# EAGLE design 01 (EAGLE 7.2.0)
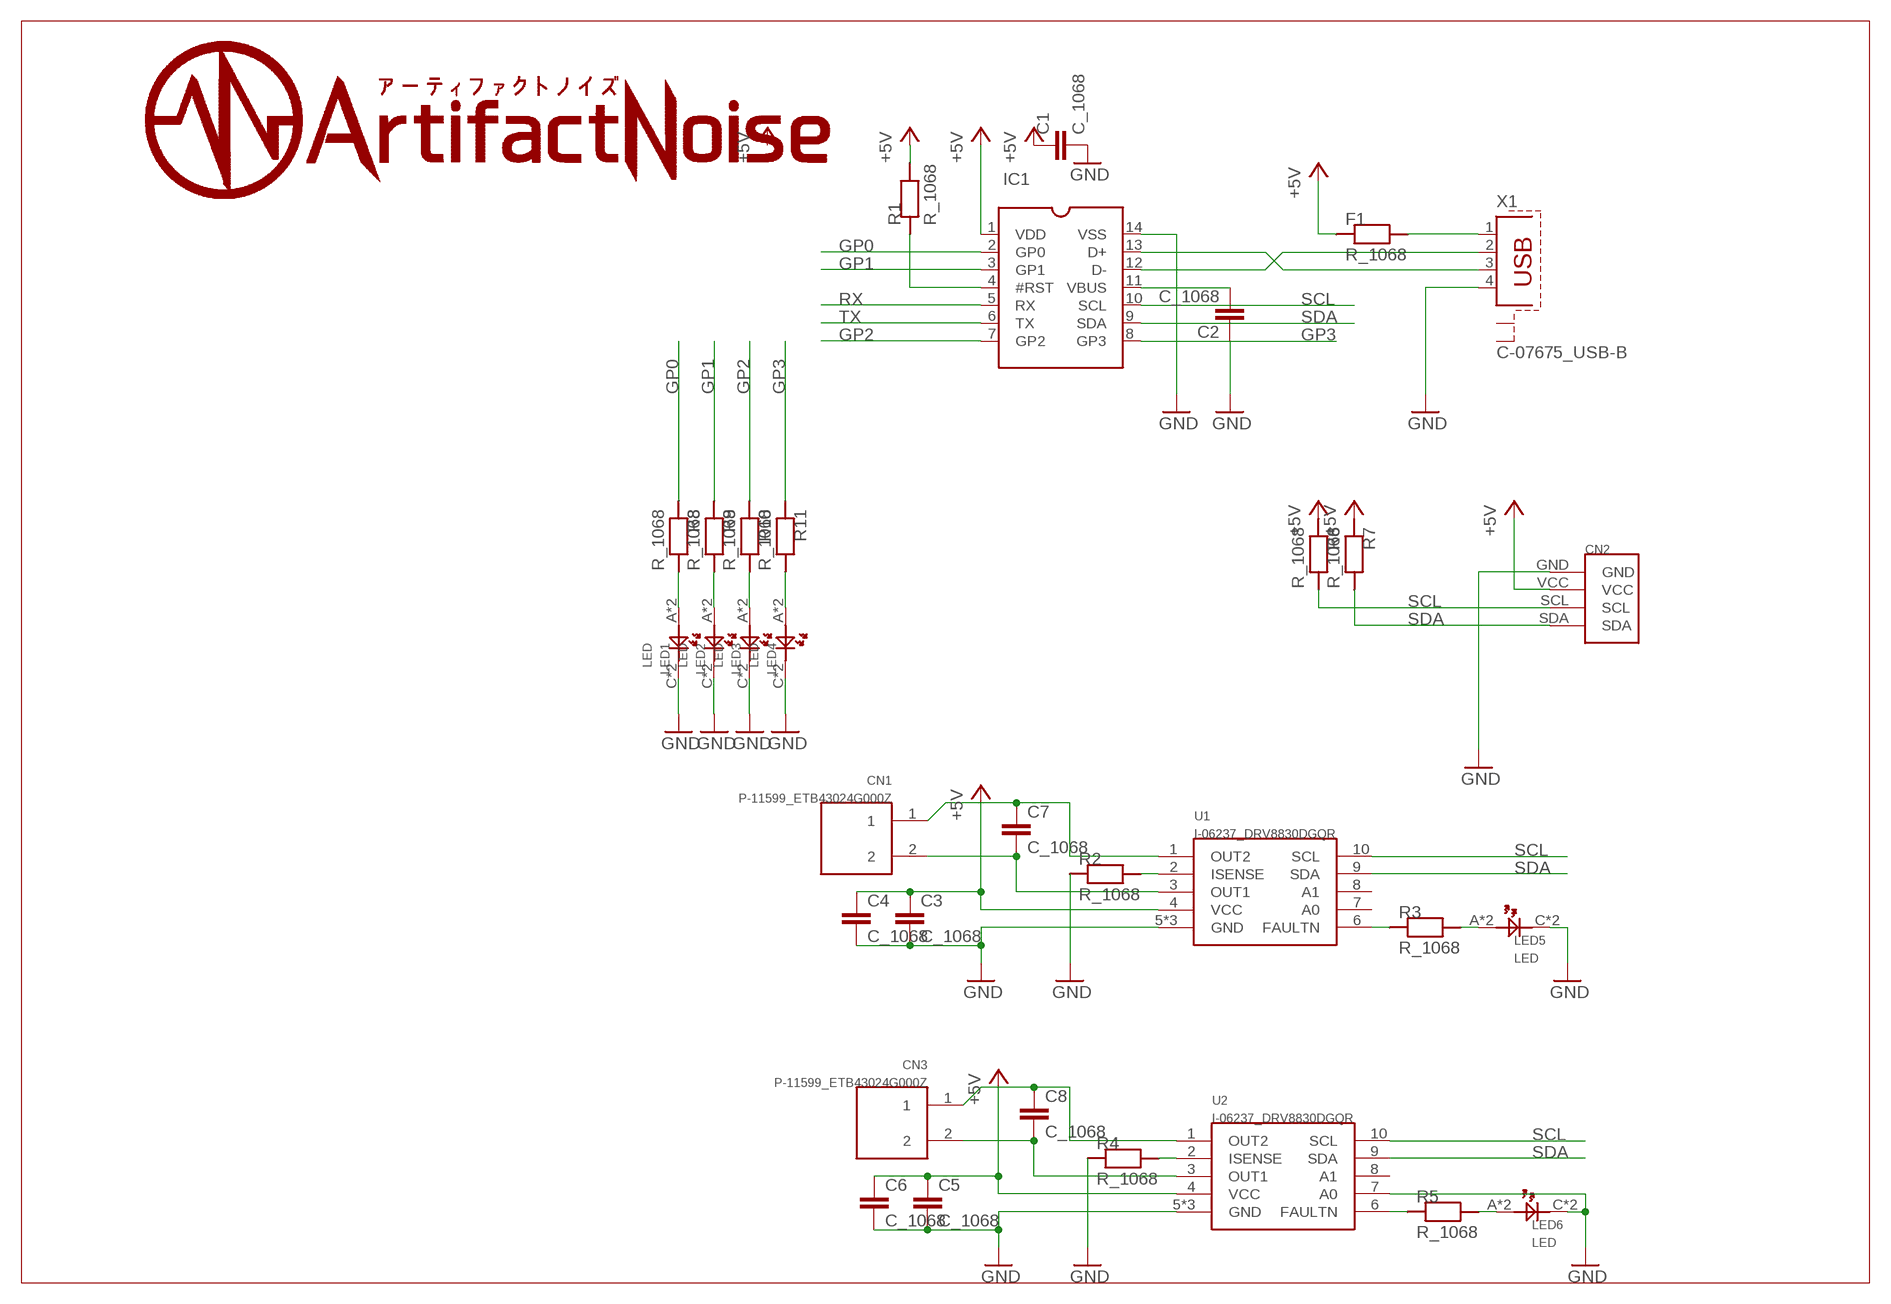
[diagram p0: schematic, sheet 1]

## Parts
C1  C_1068  [C0603]
C2  C_1068  [C0603]
C3  C_1068  [C0603]
C4  C_1068  [C0603]
C5  C_1068  [C0603]
C6  C_1068  [C0603]
C7  C_1068  [C0603]
C8  C_1068  [C0603]
CN1  P-11599_ETB43024G000Z  [ETB43024G000Z]
CN2  PIN4  [PIN4]
CN3  P-11599_ETB43024G000Z  [ETB43024G000Z]
F1  R_1068  [R0603]
IC1  _MCP2221A-I/PS  [SOCKET-14]
LED1  LED  [CHIPLED_0805]
LED2  LED  [CHIPLED_0805]
LED3  LED  [CHIPLED_0805]
LED4  LED  [CHIPLED_0805]
LED5  LED  [CHIPLED_0805]
LED6  LED  [CHIPLED_0805]
R1  R_1068  [R0603]
R2  R_1068  [R0603]
R3  R_1068  [R0603]
R4  R_1068  [R0603]
R5  R_1068  [R0603]
R6  R_1068  [R0603]
R7  R_1068  [R0603]
R8  R_1068  [R0603]
R9  R_1068  [R0603]
R10  R_1068  [R0603]
R11  R_1068  [R0603]
U1  I-06237_DRV8830DGQR  [DRV8830DGQR]
U2  I-06237_DRV8830DGQR  [DRV8830DGQR]
X1  C-07675_USB-B  [PN61729-S]

## Nets
+5V: C1.1 C1.D1 C3.1 C3.D1 C4.1 C4.D1 C5.1 C5.D1 C6.1 C6.D1 CN2.VCC F1.1 F1.D1 IC1.1(VDD) R1.2 R1.D2 R6.1 R6.D1 R7.1 R7.D1 U1.4(VCC) U2.4(VCC)
GND: C1.2 C1.D2 C2.1 C2.D1 C3.2 C3.D2 C4.2 C4.D2 C5.2 C5.D2 C6.2 C6.D2 CN2.GND IC1.14(VSS) LED1.C LED1.DC(C) LED2.C LED2.DC(C) LED3.C LED3.DC(C) LED4.C LED4.DC(C) LED5.C LED5.DC(C) LED6.C LED6.DC(C) R2.1 R2.D1 R4.1 R4.D1 U1.5(GND) U1.11(GND) U1.12(GND) U2.5(GND) U2.7(A0) U2.11(GND) U2.12(GND) X1.4
GP0: IC1.2(GP0) R8.1 R8.D1
GP1: IC1.3(GP1) R9.1 R9.D1
GP2: IC1.7(GP2) R10.1 R10.D1
GP3: IC1.8(GP3) R11.1 R11.D1
N$1: IC1.4(#RST) R1.1 R1.D1
N$2: IC1.13(D+) X1.3
N$3: IC1.12(D-) X1.2
N$4: C2.2 C2.D2 IC1.11(VBUS)
N$5: F1.2 F1.D2 X1.1
N$6: R4.2 R4.D2 U2.2(ISENSE)
N$7: C8.2 C8.D2 CN3.2 U2.3(OUT1)
N$8: C8.1 C8.D1 CN3.1 U2.1(OUT2)
N$9: LED1.A LED1.DA(A) R8.2 R8.D2
N$10: LED2.A LED2.DA(A) R9.2 R9.D2
N$11: LED3.A LED3.DA(A) R10.2 R10.D2
N$12: LED4.A LED4.DA(A) R11.2 R11.D2
N$13: R2.2 R2.D2 U1.2(ISENSE)
N$14: R5.1 R5.D1 U2.6(FAULTN)
N$15: C7.2 C7.D2 CN1.2 U1.3(OUT1)
N$16: C7.1 C7.D1 CN1.1 U1.1(OUT2)
N$17: R3.1 R3.D1 U1.6(FAULTN)
N$18: LED5.A LED5.DA(A) R3.2 R3.D2
N$19: LED6.A LED6.DA(A) R5.2 R5.D2
RX: IC1.5(RX)
SCL: CN2.SCL IC1.10(SCL) R6.2 R6.D2 U1.10(SCL) U2.10(SCL)
SDA: CN2.SDA IC1.9(SDA) R7.2 R7.D2 U1.9(SDA) U2.9(SDA)
TX: IC1.6(TX)
Unconnected: U1.7(A0) U1.8(A1) U2.8(A1) X1.S1 X1.S2

## Library data of the parts
C1-C8 = 01:C_1068
CN1 CN3 = 01:P-11599_ETB43024G000Z
CN2 = 01:PIN4
F1 R1-R11 = 01:R_1068
IC1 = 01:_MCP2221A-I/P: Dual In Line / Socket
LED1-LED6 = 01:LED
U1 U2 = 01:I-06237_DRV8830DGQR
X1 = 01:C-07675_USB-B: BERG USB connector; OC_FARNELL: unknown; OC_NEWARK: unknown

## Board
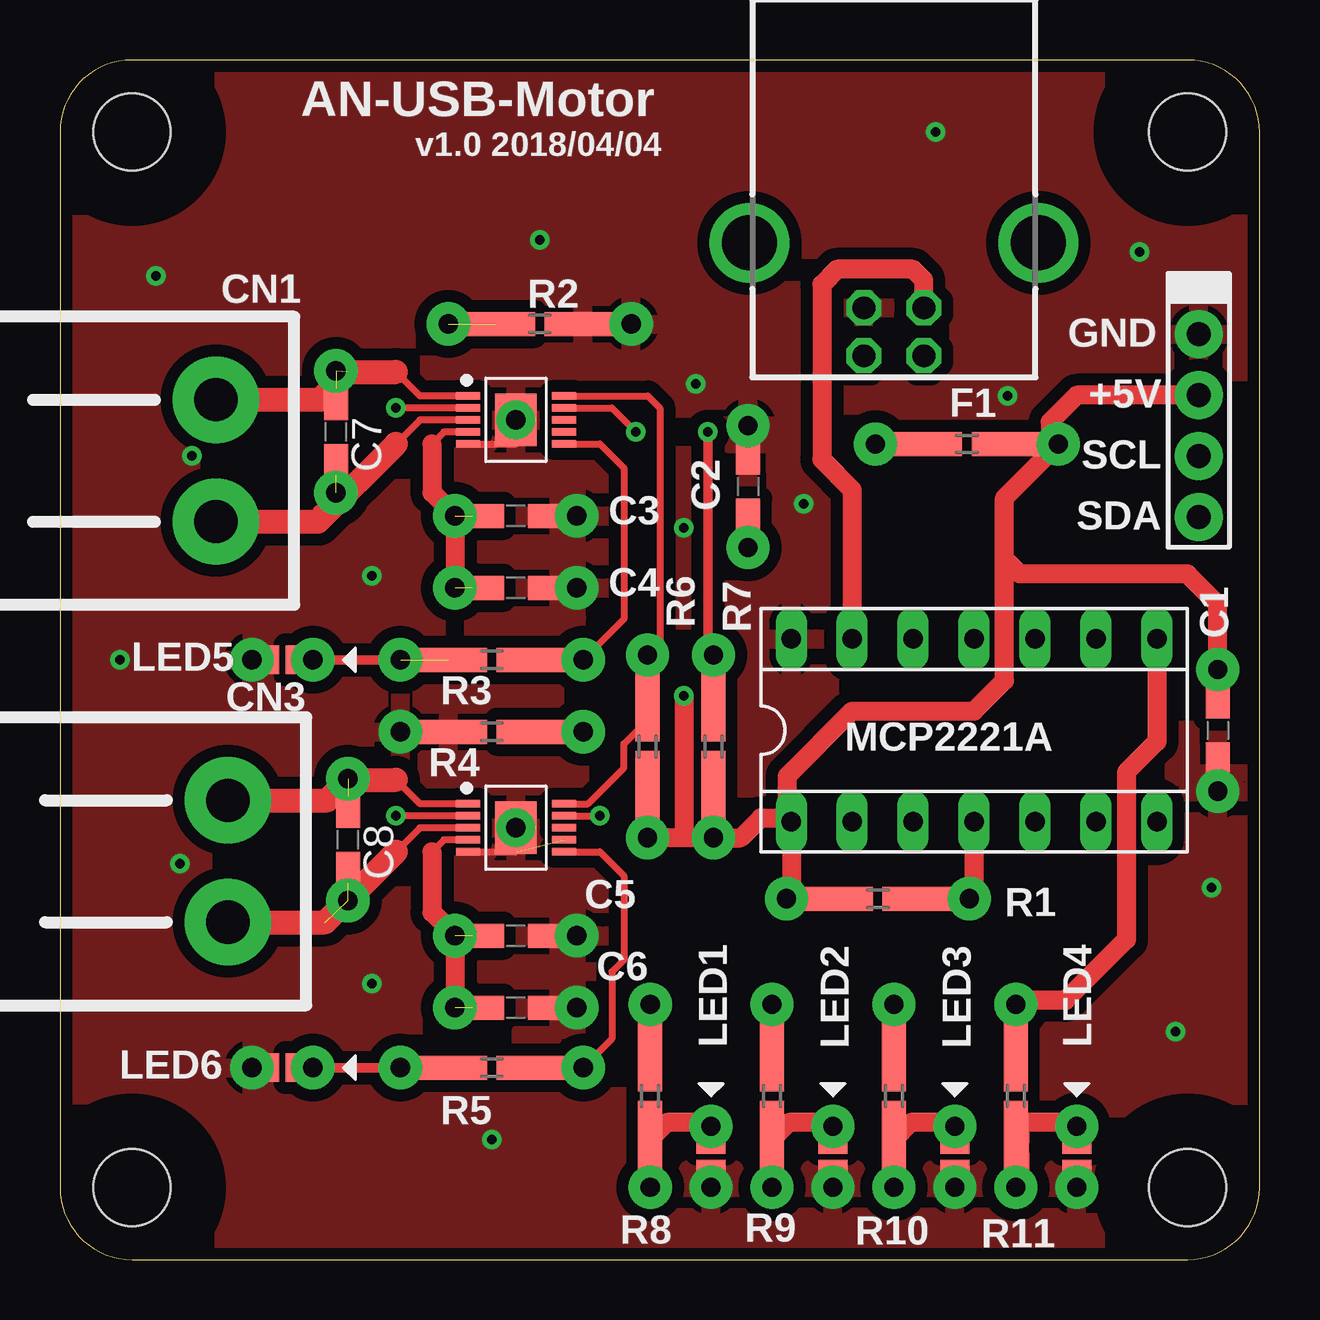
[diagram p1: board, top side]
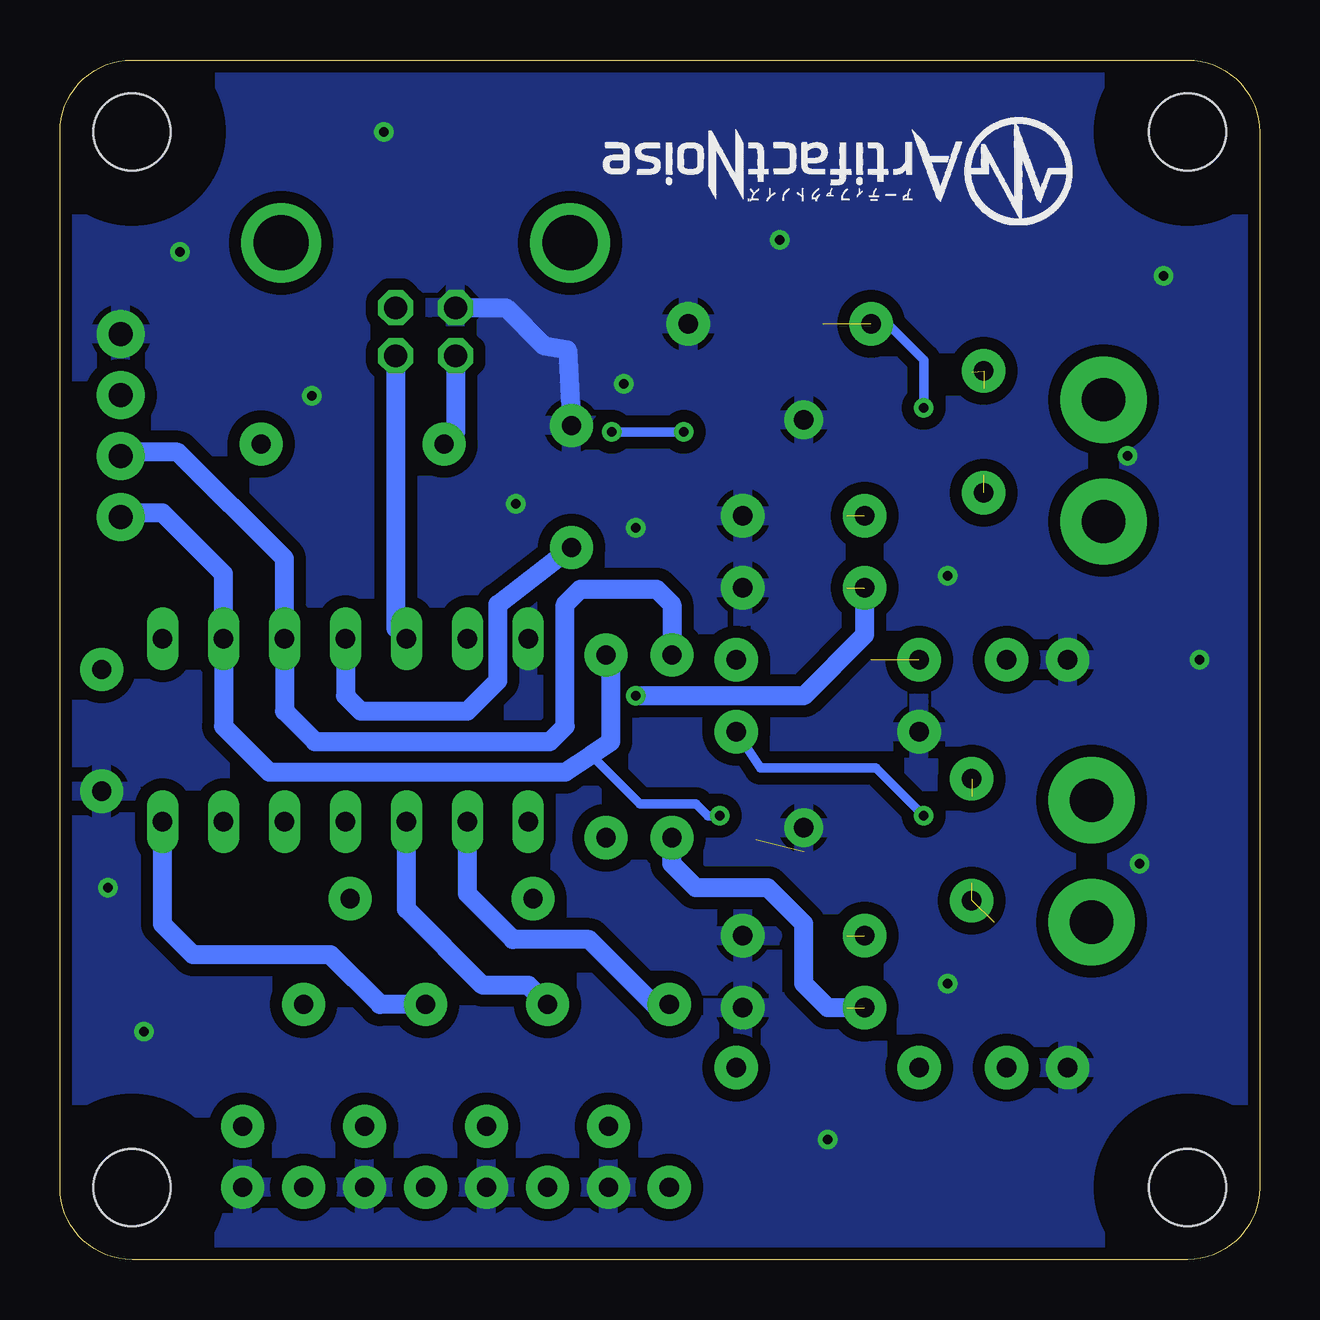
[diagram p2: board, bottom side, seen from below]

Size 50 x 50 mm. Coordinates in mm from the lower left corner, seen from the top.
Outline: 50,3 50,47 arc90 47,50 3,50 arc90 0,47 0,3 arc90 3,0 47,0 arc90 50,3
Copper layers (1*16): Top 0.035mm / dielectric 1.5mm / Bottom 0.035mm
Design rules "SeeedStudio_2layer_DRU_no_angle_20140221a": minimum track width 6mil, minimum drill 12mil, track to track 6mil, track to pad 6mil, pad to pad 6mil, via to via 6mil, smd to smd 0mil, copper to edge 10mil, drill to drill 10mil, minimum pad ring 10mil, minimum via ring 6mil, stop-mask expansion 2mil, vias tented up to drill 25mil, thermal gap 10mil
Holes 3.2 mm at 47,47 3,47 3,3 47,3
tRestrict: area -0.2,43.8 to 6.2,50.2; area -0.2,-0.2 to 6.2,6.2; area 43.8,-0.2 to 50.2,6.2; area 43.8,43.8 to 50.2,50.2
bRestrict: area -0.2,43.8 to 6.2,50.2; area -0.2,-0.2 to 6.2,6.2; area 43.8,-0.2 to 50.2,6.2; area 43.8,43.8 to 50.2,50.2

### Footprints (pad centres in the part's own frame; a part is rotated, then mirrored left to right if it is on the bottom)
C0603 = smd 2.6 x 1: 1 -1.8,0; 2 1.8,0 | drill 0.8 pad 1.8: D1 -2.54,0; D2 2.54,0
ETB43024G000Z = drill 1.8 pad 3.6: 1 2.54,0; 2 -2.54,0
PIN4 = drill 1 pad 2: GND 0,-3.81; SCL 0,1.27; SDA 0,3.81; VCC 0,-1.27
R0603 = smd 3.2 x 1: 1 -1.8,0; 2 1.8,0 | drill 0.8 pad 1.8: D1 -3.81,0; D2 3.81,0
SOCKET-14 = drill 0.813 long: 1 -7.62,-3.81; 2 -5.08,-3.81; 3 -2.54,-3.81; 4 0,-3.81; 5 2.54,-3.81; 6 5.08,-3.81; 7 7.62,-3.81; 8 7.62,3.81; 9 5.08,3.81; 10 2.54,3.81; 11 0,3.81; 12 -2.54,3.81; 13 -5.08,3.81; 14 -7.62,3.81
CHIPLED_0805 = smd 1.2 x 0.8: A 0,-1.8; C 0,-0.74 | drill 0.8 pad 1.8: DA 0,-2.54; DC 0,0
DRV8830DGQR = smd 0.3 x 1: 1 -1,-2; 2 -0.5,-2; 3 0,-2; 4 0.5,-2; 5 1,-2; 6 1,2; 7 0.5,2; 8 0,2; 9 -0.5,2; 10 -1,2 | smd 2.18 x 1.72: 11 0,0 | drill 0.8 pad 1.6: 12 0,0
PN61729-S = drill 0.95 octagon: 1 1.25,4.71; 2 -1.25,4.71; 3 -1.25,2.71; 4 1.25,2.71 | drill 2.3 pad 2.9: S1 -6.02,0; S2 6.02,0

### Placement (x,y rotation side)
C1  48.26,22.06 270 top
C2  28.68,32.22 270 top
C3  19,31 0 top
C4  19,28 0 top
C5  19,13.5 0 top
C6  19,10.5 0 top
C7  11.5,34.5 270 top
C8  12,17.5 270 top
CN1  6.5,33.3 90 top
CN2  47.46,34.76 180 top
CN3  7,16.6 90 top
F1  37.8,33.99 180 top
IC1  38.1,22.06 0 top
LED1  27.14,3.01 180 top
LED2  32.22,3.01 180 top
LED3  37.3,3.01 180 top
LED4  42.38,3.01 180 top
LED5  8,25 90 top
LED6  8,8 90 top
R1  34.09,15.04 180 top
R2  20,39 180 top
R3  18,25 180 top
R4  18,22 0 top
R5  18,8 180 top
R6  24.5,21.39 90 top
R7  27.23,21.39 90 top
R8  24.6,6.82 270 top
R9  29.68,6.82 270 top
R10  34.76,6.82 270 top
R11  39.84,6.82 270 top
U1  19,35 270 top
U2  19,18 270 top
U$1  [AN-LOGO2]  7.8,47.6 180 bottom
X1  34.76,42.38 180 top

### Tracks (layer width: path | path; a pad name or v marks a point on that pad's centre or on a via)
+5V  (via drill 0.4 pad 0.8)  (4 unrouted)
  Top 0.3: U1.4 16,34.5 15.5,34 | U2.4 16,17.5 15.5,17
  Top 0.4: 16.46,12.76 C5.1
  Top 0.406: R6.1 R6.D1 | R7.1 R7.D1 | R1.2 R1.D2
  Top 0.8: F1.1 F1.D1 41.27,33.66 | CN2.VCC 42.38,36.03 41.27,34.92 41.27,33.66 | R1.D2 30.48,15.24 IC1.1 30.32,18.41 | 26,17.58 R7.D1 28.38,17.58 29.21,18.41 30.32,18.41 | 26,17.58 R6.D1 | C1.1 C1.D1 48.26,27.3 46.99,28.57 40.01,28.57 39.37,29.21 | 30.32,18.41 30.32,20.16 33.02,22.86 38.1,22.86 39.37,24.13 39.37,29.21 | 39.37,29.21 39.37,31.75 41.27,33.66 | v26,23.5 26,17.58 | C4.D1 C3.D1 15.5,31.96 15.5,34 | C6.D1 C5.D1 15.5,14.46 15.5,17
  Bottom 0.8: C4.D1 16.46,26.04 19,23.5 v26,23.5 | C6.D1 18,10.5 19,11.5 19,14 20.5,15.5 23.5,15.5 24.5,16.5 R6.D1
GND  (via drill 0.4 pad 0.8)  (1 unrouted)
  Top 0.3: U2.5 19,17 | U1.5 19,34
  Top 0.8: LED4.C LED4.DC
  Bottom 0.8: X1.4 31.41,39.67 29.84,38.1 28.84,37.92 C2.D1
  other vias: 26.5,36.5 26,30.5 31,31.5 13,28.5 13,11.5 5,16.5 5.5,33.5 46.5,9.5 48,15.5 39.5,36 45,42 36.5,47 4,41 4,41 20,42.5 18,5 2.5,25
  pour Top (isolate 0.5): 51.27,-0.8 -0.8,-0.8 -0.8,51.27 51.27,51.27
  pour Bottom (isolate 0.5): 51.27,-0.8 -0.8,-0.8 -0.8,51.27 51.27,51.27
GP0
  Top 0.406: R8.1 R8.D1
  Bottom 0.8: R8.D1 25.23,10.63 27.94,13.34 31.11,13.34 33.02,15.24 IC1.2
GP1
  Top 0.406: R9.1 R9.D1
  Bottom 0.8: R9.D1 30.48,11.43 32.38,11.43 35.56,14.61 IC1.3
GP2
  Top 0.406: R10.1 R10.D1
  Bottom 0.8: R10.D1 36.66,10.63 38.73,12.7 44.45,12.7 45.72,13.97 IC1.7
GP3
  Top 0.406: R11.1 R11.D1
  Top 0.8: IC1.8 45.72,21.59 44.45,20.32 44.45,13.34 41.91,10.79 40.01,10.79 R11.D1
N$1
  Top 0.406: R1.1 R1.D1
  Top 0.8: IC1.4 38.1,15.24 R1.D1
N$2
  Top 0.8: X1.3 36.01,40.83 35.56,41.27 32.38,41.27 31.75,40.64 31.75,33.34 33.02,32.08 IC1.13
N$3
  Bottom 0.8: X1.2 36.01,26.32 IC1.12
N$4
  Top 0.406: C2.D2 C2.2
  Bottom 0.8: IC1.11 38.1,23.5 37.47,22.86 33.02,22.86 31.75,24.13 31.75,27.3 C2.D2
N$5
  Top 0.8: F1.D2 F1.2
  Bottom 0.8: X1.1 33.51,34.51 F1.D2
N$6  (via drill 0.4 pad 0.8)
  Top 0.3: U2.2 v14,18.5
  Top 0.4: R4.2 21.5,22 21.91,21.59 R4.D2
  Bottom 0.4: v14,18.5 16,20.5 20.81,20.5 R4.D2
N$7  (2 unrouted)
  Top 0.3: U2.3 15,18 14,17
  Top 1: CN3.2 11.06,14.06 14,17
N$8  (2 unrouted)
  Top 0.3: U2.1 15,19 14,20
  Top 1: CN3.1 11.14,19.14 12,20 14,20
N$9
  Top 0.8: LED1.A LED1.DA 27.3,5.71 25.3,5.71 R8.2 R8.D2
N$10
  Top 0.8: LED2.A LED2.DA 32.38,5.71 30.38,5.71 R9.2 R9.D2
N$11
  Top 0.8: LED3.A LED3.DA 37.47,5.71 35.45,5.71 R10.2 34.76,3.98 34.92,3.17 R10.D2
N$12
  Top 0.8: LED4.A LED4.DA 42.55,5.71 40.01,5.71 40.01,4.86 | R11.D2 40.01,3.17 40.01,4.45 40.01,4.86 | 40.01,4.86 R11.2
N$13  (via drill 0.4 pad 0.8)  (1 unrouted)
  Top 0.3: U1.2 v14,35.5
  Bottom 0.4: v14,35.5 14,37.5 15.5,39 R2.D2
N$14
  Top 0.3: U2.6 22.5,17 23.5,16 23.5,12.5 23,12 23,9.19 R5.D1 R5.1
N$15  (1 unrouted)
  Top 0.3: U1.3 15,35 14,34
  Top 0.406: 10.76,30.76 10.76,31.22 C7.D2
  Top 1: CN1.2 10.76,30.76 14,34
N$16  (2 unrouted)
  Top 0.3: U1.1 15,36 14,37
  Top 1: CN1.1 10.84,35.84 12,37 14,37
N$17
  Top 0.3: U1.6 22.5,34 23.5,33 23.5,26.69 R3.D1
  Top 0.4: R3.1 R3.D1
N$18  (1 unrouted)
  Top 0.4: R3.D2 LED5.DA
N$19
  Top 0.4: LED6.DA R5.D2 R5.2
SCL
  Top 0.3: U1.10 24.5,36 25,35.5 25,25.7 | U2.10 22,19 23.5,20.5 23.5,21.5 24.5,22.5 R6.D2
  Top 0.4: 25,25.7 R6.D2
  Top 0.406: R6.2 R6.D2
  Bottom 0.4: R6.D2
  Bottom 0.8: R6.D2 24.5,27.3 25.13,27.94 28.3,27.94 28.94,27.3 28.94,22.23 29.57,21.59 39.37,21.59 40.64,22.86 IC1.10 40.64,29.21 45.09,33.66 47.3,33.66 CN2.SCL
SDA  (via drill 0.4 pad 0.8)
  Top 0.3: U1.9 23,35.5 v24,34.5 | U2.9 v22.5,18.5
  Top 0.4: v27,34.5 27,25.46 R7.D2
  Top 0.406: R7.2 R7.D2
  Bottom 0.4: v24,34.5 v27,34.5 | v22.5,18.5 23,18.5 23.5,19 25.82,19 27.86,21.04
  Bottom 0.8: CN2.SDA 47.3,31.11 45.72,31.11 43.18,28.57 IC1.9 43.18,22.23 41.27,20.32 28.94,20.32 27.86,21.04 27.04,21.59 27.04,25 R7.D2

### Text on the board
tPlace: AN-USB-Motor | v1.0 2018/04/04 | GND | +5V | SCL | SDA | MCP2221A